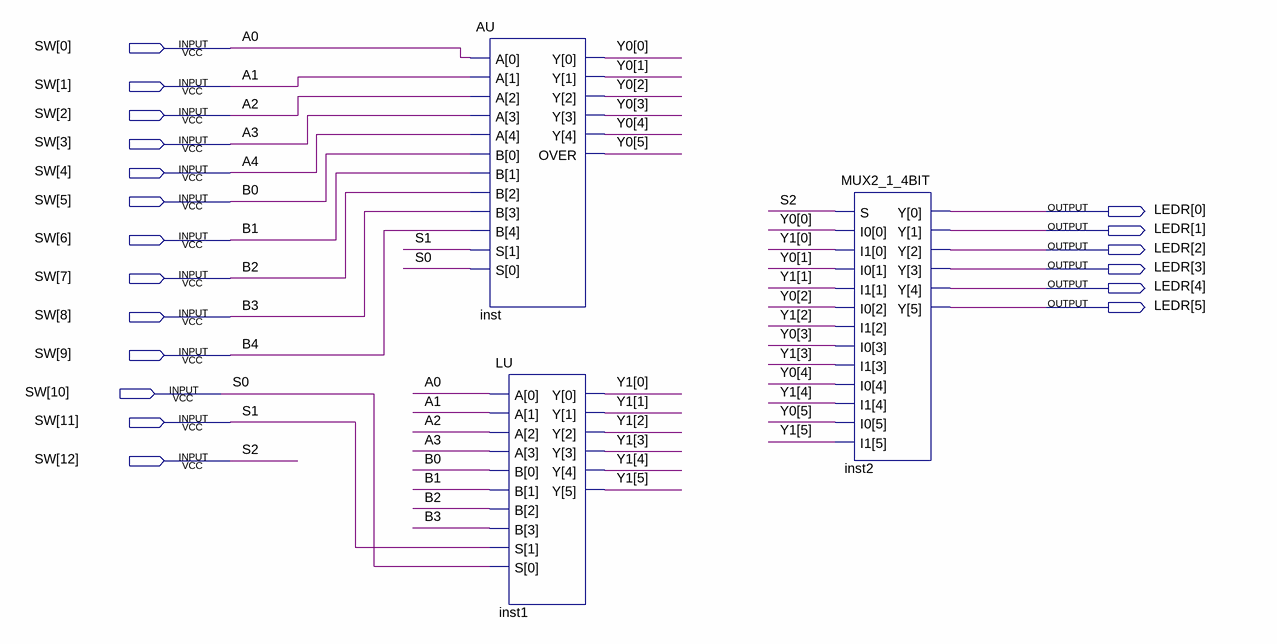
[diagram p0: schematic sheet]
// Quartus schematic ALU.bdf as structural Verilog: 3 symbols, 19 pins
module ALU (
  input  [12:0] SW,
  output [5:0] LEDR
);

  wire [5:0] Y0, Y1;

  AU inst (.A(SW[4:0]), .B(SW[9:5]), .S(SW[11:10]), .Y(Y0[4:0]), .OVER(Y0[5]));
  LU inst1 (.A(SW[3:0]), .B(SW[8:5]), .S(SW[11:10]), .Y(Y1));
  MUX2_1_4BIT inst2 (.S(SW[12]), .I0(Y0), .I1(Y1), .Y(LEDR));

  // Other names for the same wires on the sheet: A0 = SW[0]; A1 = SW[1]; A2 = SW[2]; A3 = SW[3]; A4 = SW[4];
  //   B0 = SW[5]; B1 = SW[6]; B2 = SW[7]; B3 = SW[8]; B4 = SW[9]; S0 = SW[10]; S1 = SW[11]; S2 = SW[12]
endmodule
